# EAGLE design 32u4 with A9G GPRS GSM GPS  v1.0 (EAGLE 6.1)
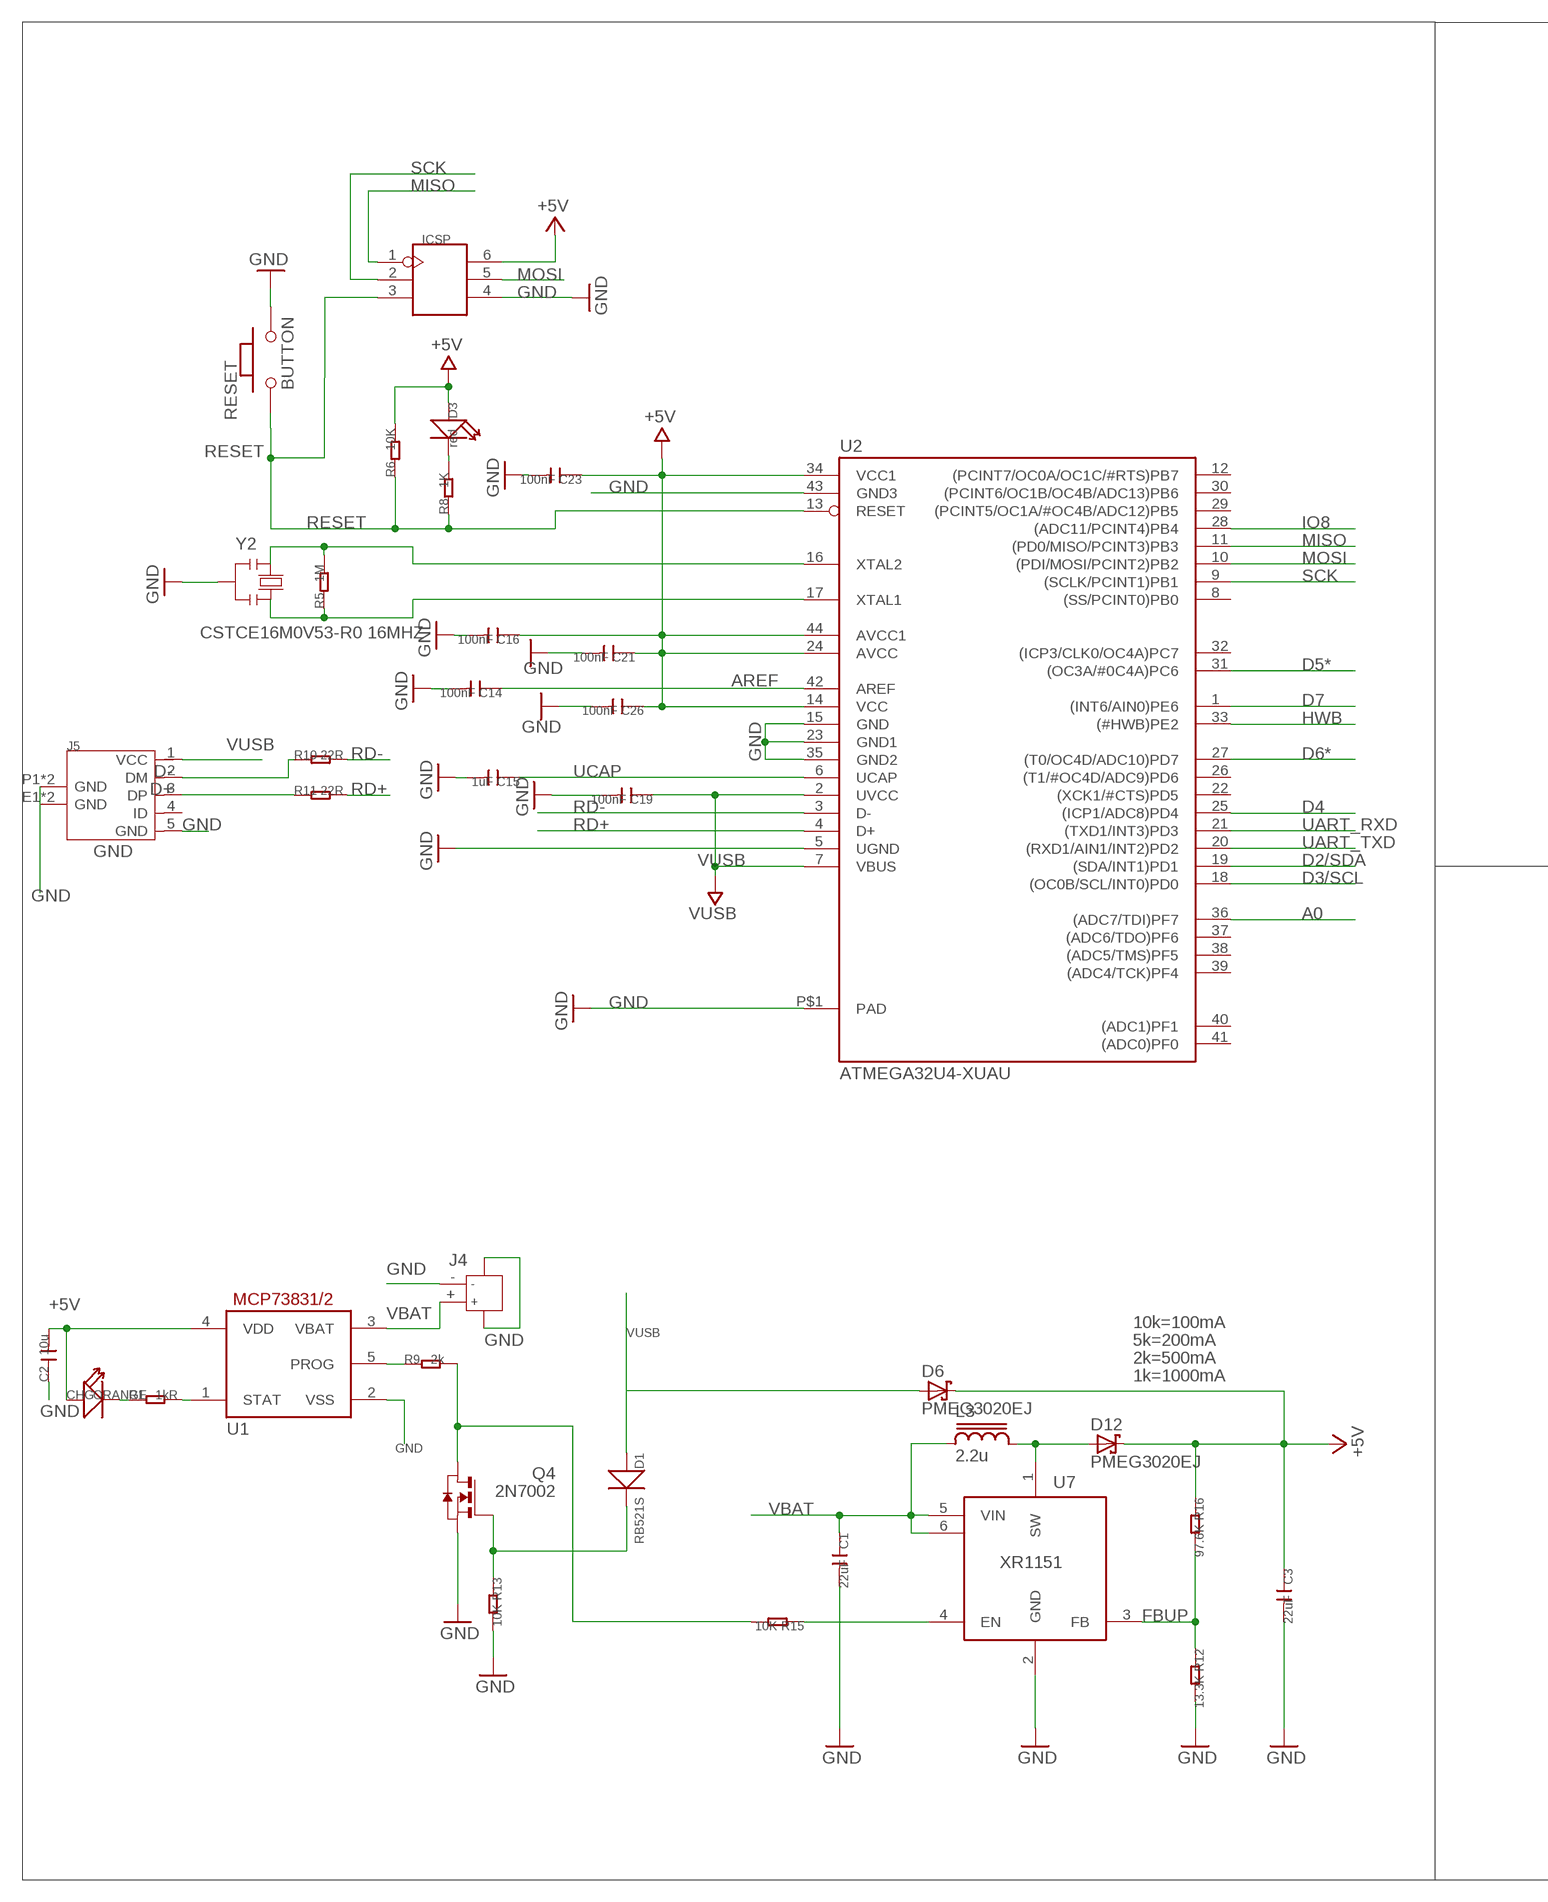
[diagram p0: schematic, sheet 1, part 1 of 2]
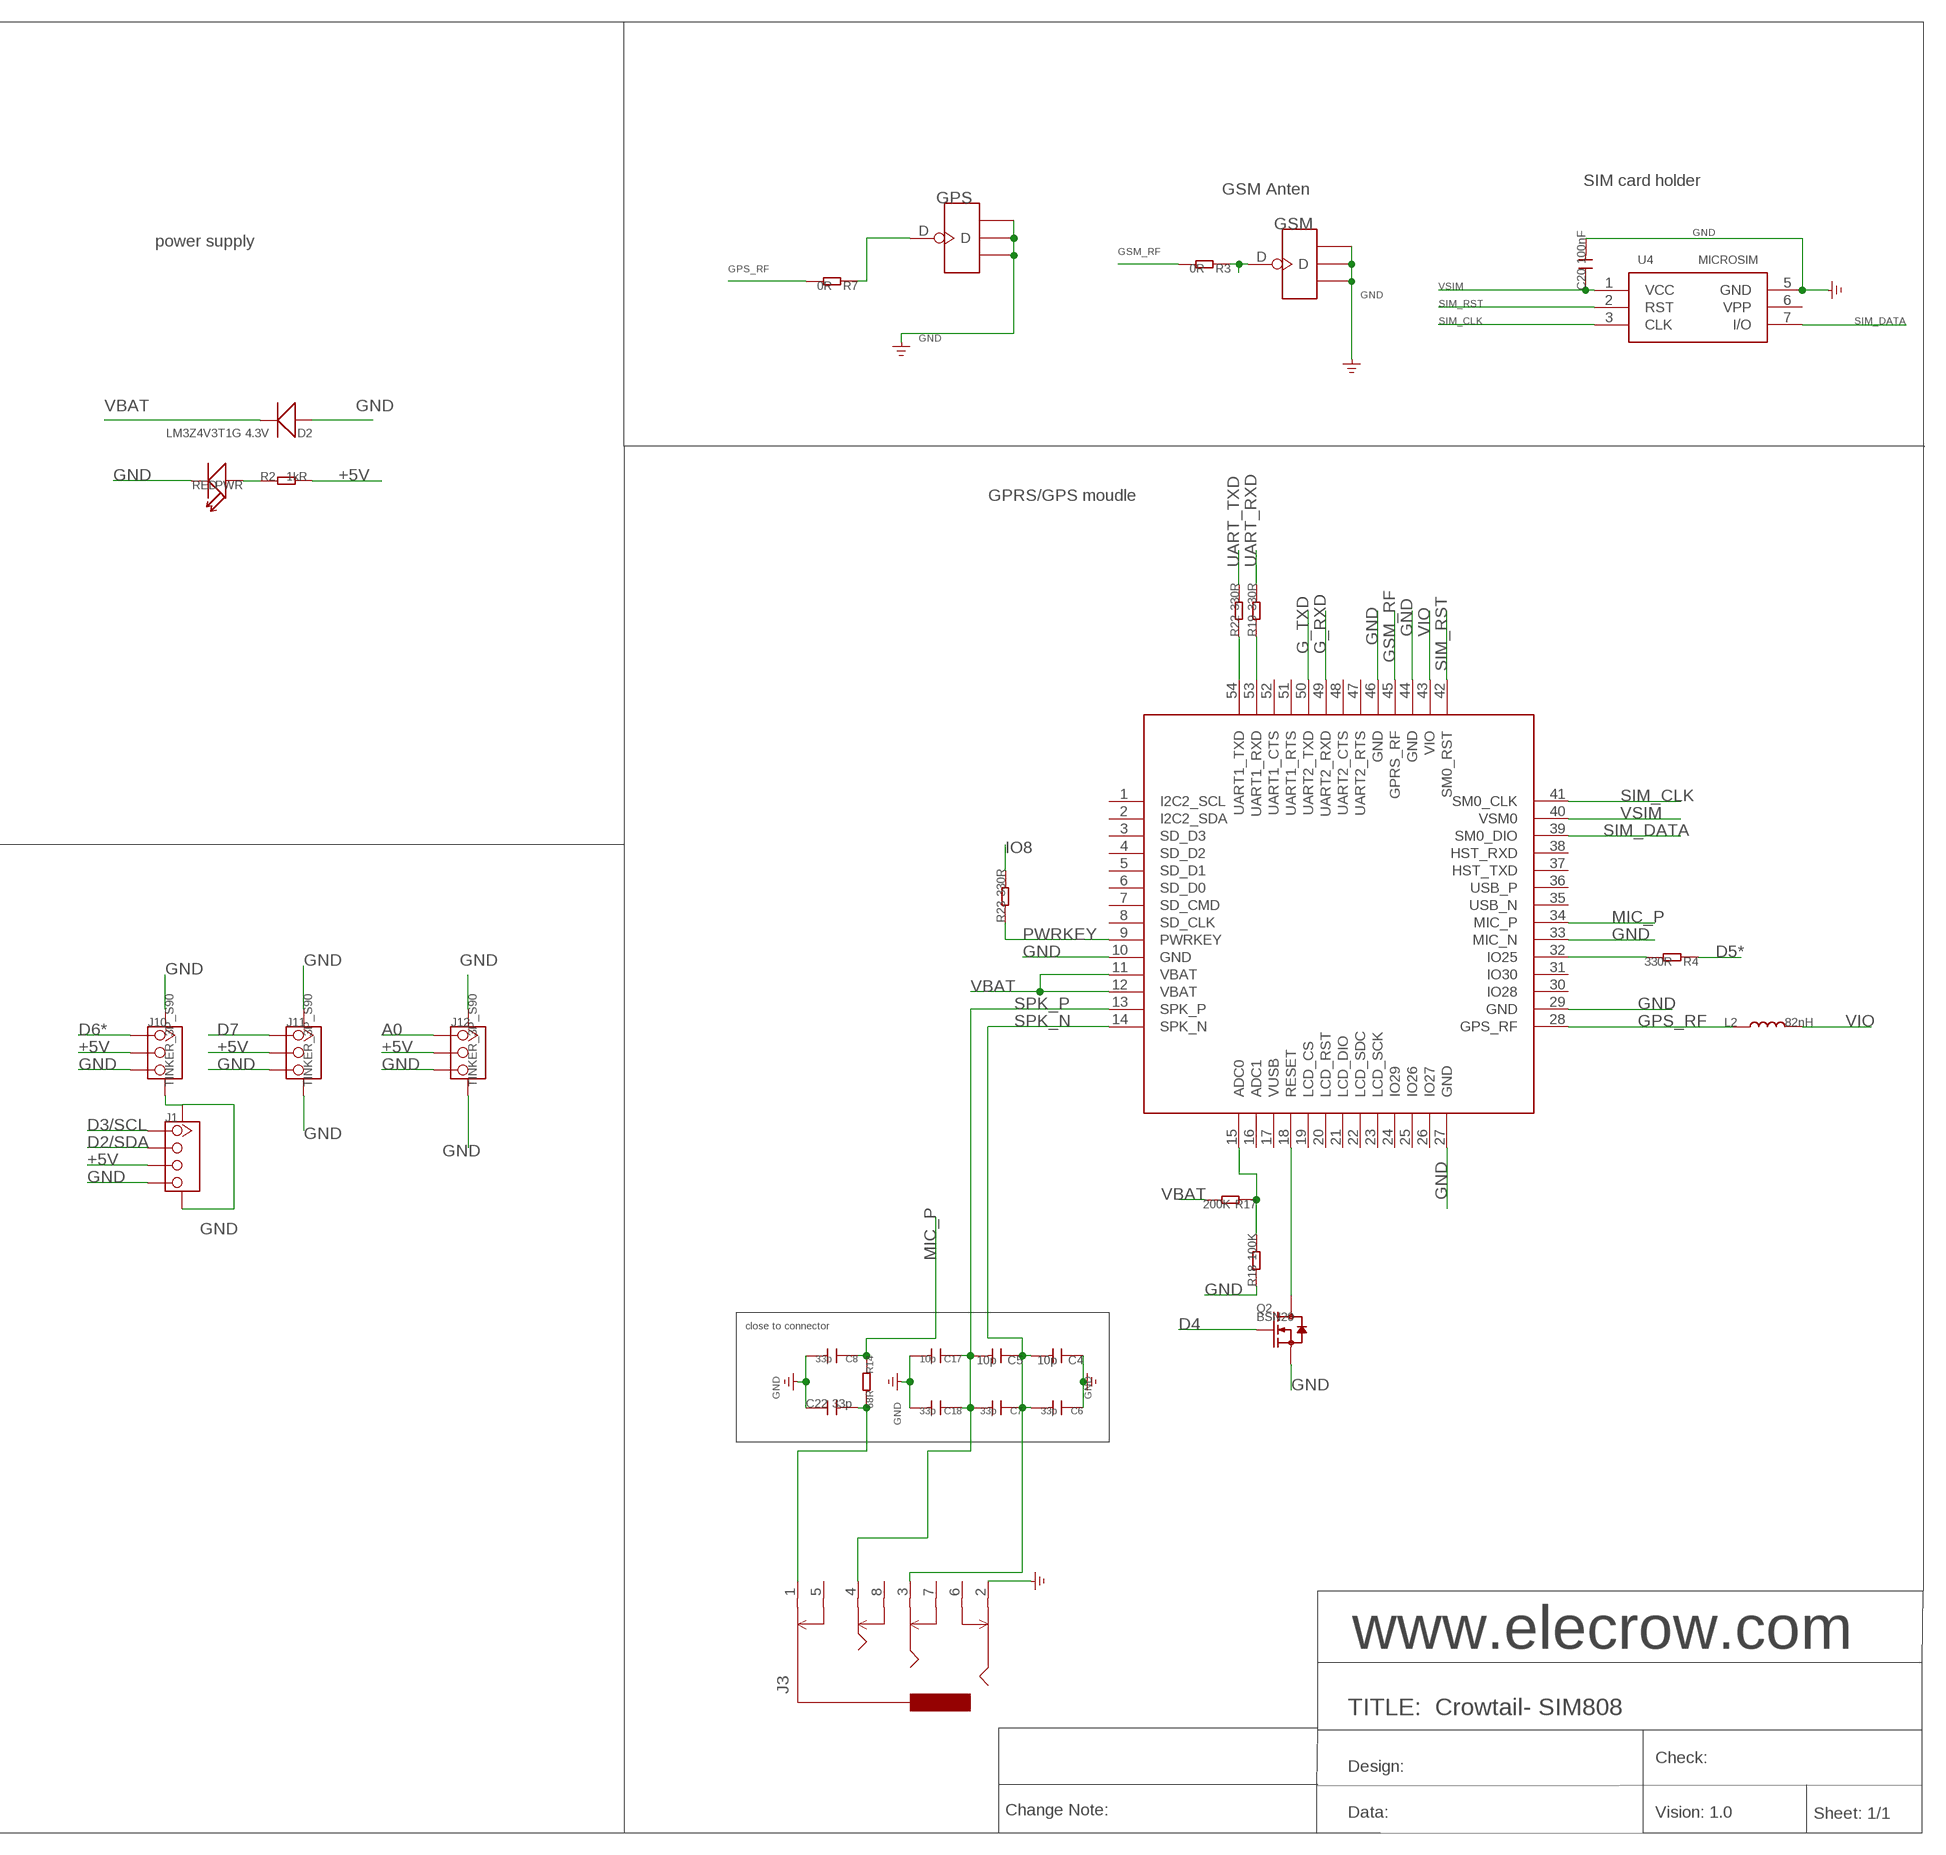
[diagram p1: schematic, sheet 1, part 2 of 2]

## Parts
C1  22uF  C-0603  [C0603]
C2  10u  C-0603  [C0603]
C3  22uF  C-0603  [C0603]
C4  10p  C-0402  [C0402]
C5  10p  C-0402  [C0402]
C6  33p  C-0402  [C0402]
C7  33p  C-0402  [C0402]
C8  33p  C-0603  [C0603]
C14  100nF  C-0603  [C0603]
C15  1uF  C-0603  [C0603]
C16  100nF  C-0603  [C0603]
C17  10p  C-0402  [C0402]
C18  33p  C-0402  [C0402]
C19  100nF  C-0603  [C0603]
C20  100nF  C-0603  [C0603]
C21  100nF  C-0603  [C0603]
C22  33p  C-0603  [C0603]
C23  100nF  C-0603  [C0603]
C26  100nF  C-0603  [C0603]
CHG  ORANGE  007-LED0603  [D0603]
D1  RB521S  D'0603'  [SOD523]
D2  LM3Z4V3T1G 4.3V  D'0805'  [SOD323]
D3  red  LED'0603'  [LED-0603]
D6  PMEG3020EJ  [SOD-323]
D12  PMEG3020EJ  [SOD-323]
GPS  ANTENNA-U-FL  [4P-U-FL]
GSM  ANTENNA-U-FL  [4P-U-FL]
ICSP  HEADER-2X3P-2.0  [2X3P-2.0]
J1  TWIG-4P-2.0-SMD-FEMALE-REINFORCE'90D'  [4P-SMD-2.0-90D]
J3  AUDIO-8P'PJ-3536-L6S'  [8P-3.5-SMD]
J4  JACK-JST-2P-SMD-PW'2.0'  [JST-SMD-2.0-90D]
J5  MICRO-USB-5P-340015001  [B-SMD-5P]
J10  TINKER_3P_S90  [TINKER_3P_S90]
J11  TINKER_3P_S90  [TINKER_3P_S90]
J12  TINKER_3P_S90  [TINKER_3P_S90]
L2  82nH  L'0603'  [L0603]
L3  2.2u  LCD32  [CD32]
PWR  RED  007-LED0603  [D0603]
Q2  BSN20  MOSFET-N'SOT23'  [SOT23@1]
Q4  2N7002  [SOT23]
R1  1kR  R-0603  [R0603]
R2  1kR  R-0603  [R0603]
R3  0R  R-0603  [R0603]
R4  330R  R-0603  [R0603]
R5  1M  R-0603  [R0603]
R6  10K  R-0603  [R0603]
R7  0R  R-0603  [R0603]
R8  1K  R-0603  [R0603]
R9  2k  R-0603  [R0603]
R10  22R  R-0603  [R0603]
R11  22R  R-0603  [R0603]
R12  13.3K  R-0603  [R0603]
R13  10K  R-0603  [R0603]
R14  68R  R-0603  [R0603]
R15  10K  R-0603  [R0603]
R16  97.6K  R-0603  [R0603]
R17  200K  R-0603  [R0603]
R18  100K  R-0603  [R0603]
R19  330R  R-0603  [R0603]
R22  330R  R-0603  [R0603]
R23  330R  R-0603  [R0603]
RESET  BUTTON  PB157  [157SW]
U1  MCP73831/OT  [SOT23-5L]
U2  ATMEGA32U4-XUAU  [TQFP44-PAD]
U4  MICROSIM  [MICROSIM]
U5  A9G  [A9G]
U7  XR1151  [SOT23-6L]
Y2  CSTCE16M0V53-R0 16MHZ  RESONATORMU  [RESONATOR]

## Nets
+5V: C2.2 C3.1 C16.1 C21.1 C23.1 C26.1 CHG.+ D3.+ D6.C D12.C ICSP.6 J1.3 J10.2 J11.2 J12.2 R2.2 R6.2 R16.1 U1.4(VDD) U2.14(VCC) U2.24(AVCC) U2.34(VCC1) U2.44(AVCC1)
A0: J12.1 U2.36((ADC7/TDI)PF7)
AREF [aref]: C14.1 U2.42(AREF)
D2/SDA: J1.2 U2.19((SDA/INT1)PD1)
D3/SCL: J1.1 U2.18((OC0B/SCL/INT0)PD0)
D4: Q2.1(G) U2.25((ICP1/ADC8)PD4)
D5*: R4.1 U2.31((OC3A/#0C4A)PC6)
D6*: J10.1 U2.27((T0/OC4D/ADC10)PD7)
D7: J11.1 U2.1((INT6/AIN0)PE6)
D+: J5.3(DP) R11.1
D-: J5.2(DM) R10.1
FBUP: R12.1 R16.2 U7.3(FB)
G_RXD: U5.49(UART2_RXD)
G_TXD: U5.50(UART2_TXD)
GND: C1.2 C2.1 C3.2 C4.1 C6.1 C8.2 C14.2 C15.2 C16.2 C17.2 C18.2 C19.2 C20.2 C21.2 C22.1 C23.2 C26.2 D2.+ GPS.GND1 GPS.GND2 GPS.GND3 GSM.GND1 GSM.GND2 GSM.GND3 ICSP.4 J1.4 J1.SS1 J1.SS2 J3.2 J4.3 J4.4 J4.- J5.5(GND) J5.E1(GND) J5.E2(GND) J5.P1(GND) J5.P2(GND) J10.3 J10.SS1 J10.SS2 J11.3 J11.SS1 J11.SS2 J12.3 J12.SS1 J12.SS2 PWR.- Q2.2(S) Q4.2(S) R12.2 R13.2 R18.1 RESET.2 U1.2(VSS) U2.5(UGND) U2.15(GND) U2.23(GND1) U2.35(GND2) U2.43(GND3) U2.P$1(PAD) U4.5(GND) U5.10(GND) U5.27(GND) U5.29(GND) U5.33(MIC_N) U5.44(GND) U5.46(GND) U7.2(GND) Y2.2
GPIO2: R4.2 U5.32(IO25)
GPS_RF: L2.1 R7.2 U5.28(GPS_RF)
GSM_RF: R3.2 U5.45(GPRS_RF)
HWB: U2.33((#HWB)PE2)
IO8: R23.2 U2.28((ADC11/PCINT4)PB4)
MIC_P: C8.1 R14.1 U5.34(MIC_P)
MISO: ICSP.1 U2.11((PD0/MISO/PCINT3)PB3)
MOSI: ICSP.5 U2.10((PDI/MOSI/PCINT2)PB2)
N$1: D12.A L3.2 U7.1(SW)
N$2: Q4.3(D) R9.2 R15.2
N$3: D1.- Q4.1(G) R13.1
N$4: R17.1 R18.2 U5.15(ADC0)
N$5: GSM.D R3.1
N$6: PWR.+ R2.1
N$7: GPS.D R7.1
N$8: Q2.3(D) U5.18(RESET)
N$9: R19.1 U5.53(UART1_RXD)
N$10: R15.1 U7.4(EN)
N$11: CHG.- R1.1
N$12: R22.1 U5.54(UART1_TXD)
N$15: D3.- R8.2
N$20: R1.2 U1.1(STAT)
N$30: C22.2 J3.1 R14.2
N$31: R9.1 U1.5(PROG)
PWRKEY: R23.1 U5.9(PWRKEY)
RD+: R11.2 U2.4(D+)
RD-: R10.2 U2.3(D-)
RESET: ICSP.3 R6.1 R8.1 RESET.1 U2.13(RESET)
SCK: ICSP.2 U2.9((SCLK/PCINT1)PB1)
SIM_CLK: U4.3(CLK) U5.41(SM0_CLK)
SIM_DATA: U4.7(I/O) U5.39(SM0_DIO)
SIM_RST: U4.2(RST) U5.42(SM0_RST)
SPK_N: C4.2 C5.1 C6.2 C7.1 J3.3 U5.14(SPK_N)
SPK_P: C5.2 C7.2 C17.1 C18.1 J3.4 U5.13(SPK_P)
UART_RXD: R19.2 U2.21((TXD1/INT3)PD3)
UART_TXD: R22.2 U2.20((RXD1/AIN1/INT2)PD2)
UCAP: C15.1 U2.6(UCAP)
VBAT: C1.1 D2.- J4.+ L3.1 R17.2 U1.3(VBAT) U5.11(VBAT) U5.12(VBAT) U7.5(VIN) U7.6(VIN1)
VIO: L2.2 U5.43(VIO)
VSIM: C20.1 U4.1(VCC) U5.40(VSM0)
VUSB: C19.1 D1.+ D6.A J5.1(VCC) U2.2(UVCC) U2.7(VBUS)
XTAL3: R5.2 U2.16(XTAL2) Y2.1
XTAL4: R5.1 U2.17(XTAL1) Y2.3
Unconnected: J3.5 J3.6 J3.7 J3.8 J5.4(ID) U2.8((SS/PCINT0)PB0) U2.12((PCINT7/OC0A/OC1C/#RTS)PB7) U2.22((XCK1/#CTS)PD5) U2.26((T1/#OC4D/ADC9)PD6) U2.29((PCINT5/OC1A/#OC4B/ADC12)PB5) U2.30((PCINT6/OC1B/OC4B/ADC13)PB6) U2.32((ICP3/CLK0/OC4A)PC7) U2.37((ADC6/TDO)PF6) U2.38((ADC5/TMS)PF5) U2.39((ADC4/TCK)PF4) U2.40((ADC1)PF1) U2.41((ADC0)PF0) U4.6(VPP) U5.1(I2C2_SCL) U5.2(I2C2_SDA) U5.3(SD_D3) U5.4(SD_D2) U5.5(SD_D1) U5.6(SD_D0) U5.7(SD_CMD) U5.8(SD_CLK) U5.16(ADC1) U5.17(VUSB) U5.19(LCD_CS) U5.20(LCD_RST) U5.21(LCD_DIO) U5.22(LCD_SDC) U5.23(LCD_SCK) U5.24(IO29) U5.25(IO26) U5.26(IO27) U5.30(IO28) U5.31(IO30) U5.35(USB_N) U5.36(USB_P) U5.37(HST_TXD) U5.38(HST_RXD) U5.47(UART2_RTS) U5.48(UART2_CTS) U5.51(UART1_RTS) U5.52(UART1_CTS)

## Notes on the sheet
- SIM card holder
- GSM Anten
- power supply
- GPRS/GPS moudle
- 10k=100mA
- 5k=200mA
- 2k=500mA | close to connector
- 1k=1000mA
- www.elecrow.com
- TITLE:  Crowtail- SIM808
- Check:
- Design:
- Change Note: | Data: | Vision: 1.0 | Sheet: 1/1

## Library data of the parts
C1-C8 C14-C23 C26 = Discrete:C*: Ceramic Capacitors
CHG PWR = Discrete:007-LED*
D1 D2 = Discrete:D*
D3 = Discrete:LED*
D6 D12 = Max-Diodes:PMEG3020
GPS GSM = Connector:ANTENNA-U-FL
ICSP = Connector:HEADER-2X3P
J1 = Connector:TWIG-4P-2.0-SMD-FEMALE-REINFORCE
J3 = template:AUDIO-8P
J4 = Connector:JACK-JST-2P-SMD-PW
J5 = OPL Eagle Library:MICRO-USB-5P: ST-USB-001E：MICRO USB B SMD R/A
J10-J12 = Connector:TINKER_3P_S90
L2 = Discrete:L*
L3 = Max-RCL:L
Q2 = Discrete:MOSFET-N: IRLL014: http://www.vishay.com/docs/91319/sihll014.pdf
Q4 = Max-Mosfets:2N7002
R1-R19 R22 R23 = Discrete:R*
RESET = MySMD:PB157
U1 = adafruit:MCP73831: MCP73831/2 Miniature Single-Cell, Fully Integrated Li-Ion, Li-Polymer Charge Management Controllers. Nice and small simple lipoly charge controller, with adjustable current and status output (LED) http://www.ladyada.net/library/pcb/eaglelibrary.html
U2 = SmartPrj:ATMEGA32U4-XU
U4 = Connector:MICROSIM
U5 = IC:A9G
U7 = Max-SwitchingRegulators:XR1151
Y2 = SmartPrj:RESONATOR

## Net classes
0 default: width 0.152 mm, drill 0.152 mm, clearance 0.152 mm
1 power: width 0.61 mm, drill 0.61 mm, clearance 0.203 mm
2 gnd: width 0.305 mm, drill 0.559 mm, clearance 0.203 mm
3 usbvcc: width 0.508 mm, drill 0.61 mm, clearance 0.203 mm
4 aref: width 0.254 mm, drill 0.61 mm, clearance 0.254 mm

## Board
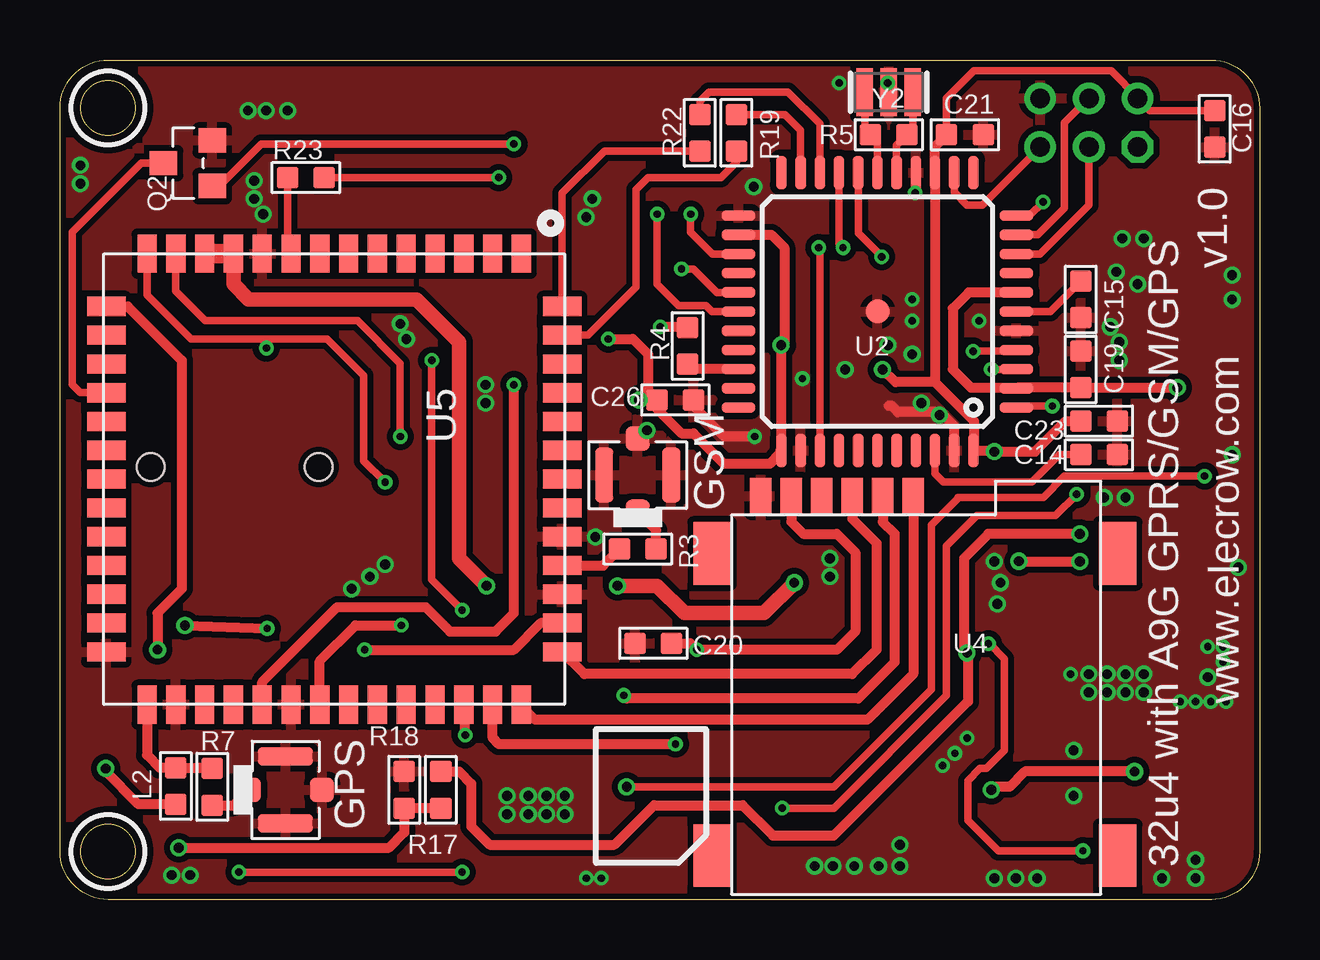
[diagram p2: board, top side]
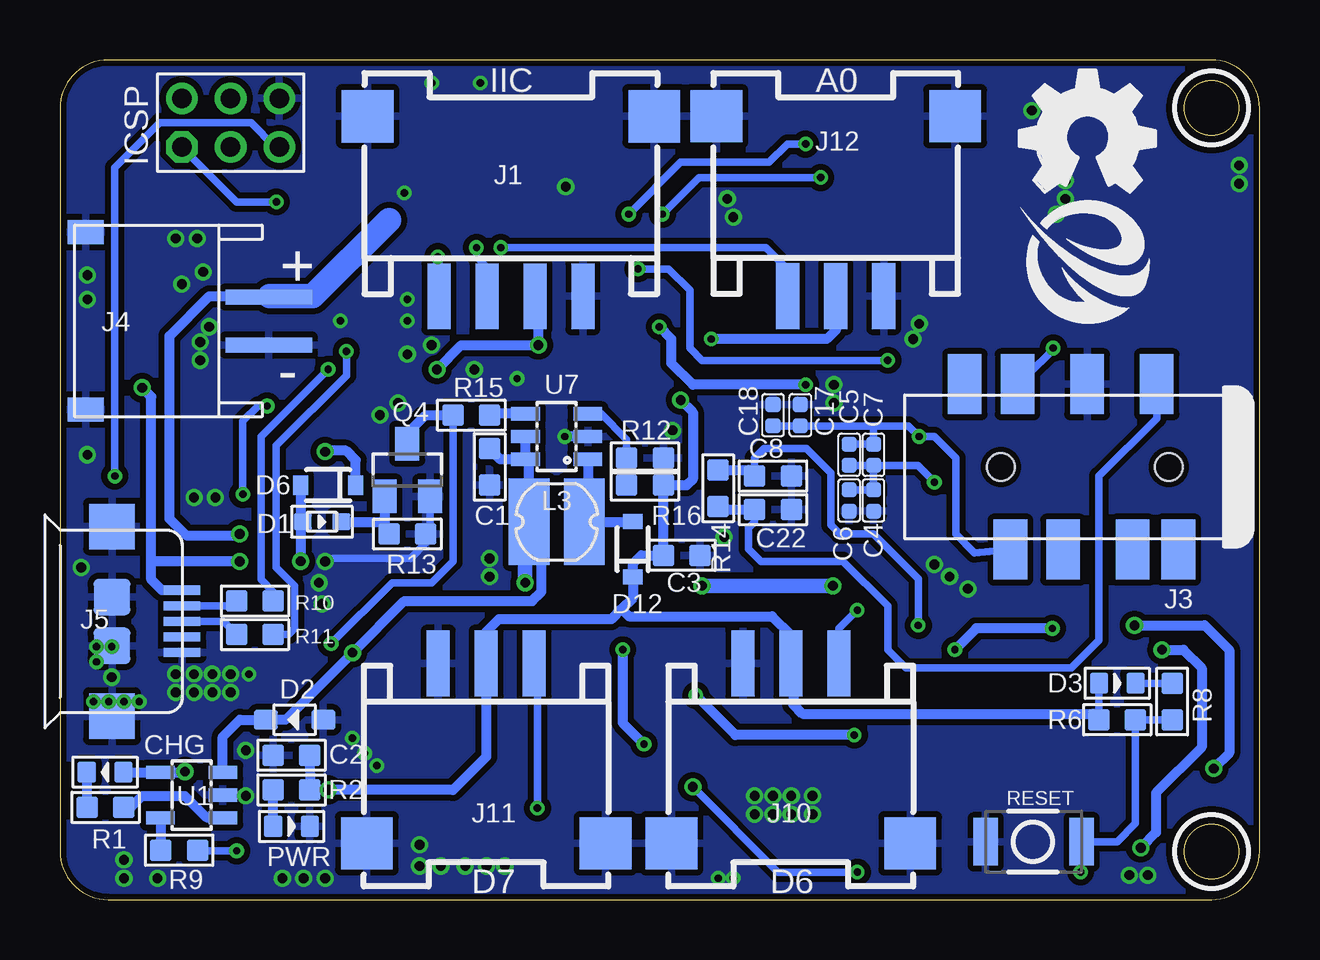
[diagram p3: board, bottom side, seen from below]

Size 50 x 35 mm. Coordinates in mm from the lower left corner, seen from the top.
Outline: 50,33 50,2 arc-90 48,0 2,0 arc-90 0,2 0,33 arc-90 2,35 48,35 arc-90 50,33
Outline: circle at 2,2 radius 1.14
Outline: circle at 2,33 radius 1.14
Copper layers (1*16): Top 0.035mm / dielectric 1.5mm / Bottom 0.035mm
Design rules "default": minimum track width 6mil, minimum drill 12mil, track to track 6mil, track to pad 6mil, pad to pad 6mil, via to via 6mil, smd to smd 0mil, copper to edge 10mil, drill to drill 10mil, minimum pad ring 10mil, minimum via ring 6mil, stop-mask expansion 2mil, vias tented up to drill 100mil, thermal gap 10mil
tRestrict: area 0.5,0.5 to 3.5,3.5; area 0.5,31.5 to 3.5,34.5
bRestrict: area 14.3,41.9 to 14.4,43.3; area 0.5,0.5 to 3.5,3.5; area 0.5,31.5 to 3.5,34.5

### Footprints (pad centres in the part's own frame; a part is rotated, then mirrored left to right if it is on the bottom)
C0603 = smd 0.889 x 0.889: 1 -0.762,0; 2 0.762,0
C0402 = smd 0.635 x 0.635: 1 -0.445,0; 2 0.445,0
D0603 = smd 0.762 x 0.889: + -0.762,0; - 0.762,0
SOD523 = smd 0.762 x 0.7: + -0.8,0; - 0.8,0
SOD323 = smd 1 x 0.8: + -1.2,0; - 1.2,0
LED-0603 = smd 0.762 x 0.889: + -0.762,0; - 0.762,0
SOD-323 = smd 0.63 x 0.83: A 1.15,0; C -1.15,0
4P-U-FL = smd 1.016 x 1.016: D -1.524,0; GND3 1.524,0 | smd 2.286 x 0.762: GND1 0,1.397; GND2 0,-1.397
2X3P-2.0 = drill 0.813 pad 1.27 octagon: 1 -1.016,2.032 | drill 0.813 pad 1.27: 2 -1.016,0; 3 -1.016,-2.032; 4 1.016,-2.032; 5 1.016,0; 6 1.016,2.032
4P-SMD-2.0-90D = smd 0.965 x 2.74: 1 -3,-0.1; 2 -1,-0.1; 3 1,-0.1; 4 3,-0.1 | smd 2.159 x 2.184: SS1 -5.974,7.4; SS2 5.974,7.4
8P-3.5-SMD = smd 1.4 x 2.5: 1 2.8,-3.45; 2 5.7,-3.45; 3 8.6,-3.45; 4 8.9,3.45; 5 1.9,3.45; 6 3.8,3.45; 7 6.7,3.45; 8 10.8,-3.45 | hole 1.149: 2.3,0; 9.3,0
JST-SMD-2.0-90D = smd 1 x 1.5: 3 3.7,-2.54; 4 -3.7,-2.54 | smd 0.635 x 3.6: + -1,5.08; - 1,5.08
B-SMD-5P = smd 0.38 x 1.52: 1 -1.3,2.54; 2 -0.65,2.54; 3 0,2.54; 4 0.65,2.54; 5 1.3,2.54 | smd 1.524 x 1.524: E1 -1.016,-0.381; E2 1.016,-0.381 | smd 1.9 x 1.9: P1 -3.95,-0.381; P2 3.95,-0.381
TINKER_3P_S90 = smd 0.965 x 2.74: 1 -1.984,-4.545; 2 0.016,-4.545; 3 2.016,-4.545 | smd 2.159 x 2.184: SS1 -4.958,2.955; SS2 4.99,2.955
L0603 = smd 0.889 x 0.889: 1 -0.762,0; 2 0.762,0
CD32 = smd 3.6 x 1.7: 1 0,1.15; 2 0,-1.15
SOT23@1 = smd 1.016 x 1.143: 1 -0.95,-1.016; 2 0.95,-1.016; 3 0,1.016
SOT23 = smd 1 x 1.4: 1 -0.95,-1.1; 2 0.95,-1.1; 3 0,1.1
R0603 = smd 0.889 x 0.889: 1 -0.762,0; 2 0.762,0
157SW = smd 1.016 x 1.981: 1 0,0; 2 4,0
SOT23-5L = smd 0.55 x 1.2: 1 -0.95,-1.3; 2 0,-1.3; 3 0.95,-1.3; 4 0.95,1.3; 5 -0.95,1.3
TQFP44-PAD = smd 1.4 x 0.45: 1 -5.8,4; 2 -5.8,3.2; 3 -5.8,2.4; 4 -5.8,1.6; 5 -5.8,0.8; 6 -5.8,0; 7 -5.8,-0.8; 8 -5.8,-1.6; 9 -5.8,-2.4; 10 -5.8,-3.2; 11 -5.8,-4; 23 5.8,-4; 24 5.8,-3.2; 25 5.8,-2.4; 26 5.8,-1.6; 27 5.8,-0.8; 28 5.8,0; 29 5.8,0.8; 30 5.8,1.6; 31 5.8,2.4; 32 5.8,3.2; 33 5.8,4 | smd 0.45 x 1.4: 12 -4,-5.8; 13 -3.2,-5.8; 14 -2.4,-5.8; 15 -1.6,-5.8; 16 -0.8,-5.8; 17 0,-5.8; 18 0.8,-5.8; 19 1.6,-5.8; 20 2.4,-5.8; 21 3.2,-5.8; 22 4,-5.8; 34 4,5.8; 35 3.2,5.8; 36 2.4,5.8; 37 1.6,5.8; 38 0.8,5.8; 39 0,5.8; 40 -0.8,5.8; 41 -1.6,5.8; 42 -2.4,5.8; 43 -3.2,5.8; 44 -4,5.8 | smd 1 x 1: P$1 0,0
MICROSIM = smd 1.5 x 0.9: 1 -0.8,2.5; 2 -0.8,5.04; 3 -0.8,7.58; 5 -0.8,1.23; 6 -0.8,3.77; 7 -0.8,6.31 | smd 2.61 x 1.56: P$1 1.6,-0.8; P$2 14.2,-0.8; P$3 14.2,16.1; P$4 1.6,16.1
A9G = smd 1.6 x 0.8: 1 -9.4,7.8; 2 -9.4,6.6; 3 -9.4,5.4; 4 -9.4,4.2; 5 -9.4,3; 6 -9.4,1.8; 7 -9.4,0.6; 8 -9.4,-0.6; 9 -9.4,-1.8; 10 -9.4,-3; 11 -9.4,-4.2; 12 -9.4,-5.4; 13 -9.4,-6.6; 14 -9.4,-7.8; 28 9.4,-7.8; 29 9.4,-6.6; 30 9.4,-5.4; 31 9.4,-4.2; 32 9.4,-3; 33 9.4,-1.8; 34 9.4,-0.6; 35 9.4,0.6; 36 9.4,1.8; 37 9.4,3; 38 9.4,4.2; 39 9.4,5.4; 40 9.4,6.6; 41 9.4,7.8 | smd 0.8 x 1.6: 15 -7.2,-9.5; 16 -6,-9.5; 17 -4.8,-9.5; 18 -3.6,-9.5; 19 -2.4,-9.5; 20 -1.2,-9.5; 21 0,-9.5; 22 1.2,-9.5; 23 2.4,-9.5; 24 3.6,-9.5; 25 4.8,-9.5; 26 6,-9.5; 27 7.2,-9.5; 42 7.2,9.5; 43 6,9.5; 44 4.8,9.5; 45 3.6,9.5; 46 2.4,9.5; 47 1.2,9.5; 48 0,9.5; 49 -1.2,9.5; 50 -2.4,9.5; 51 -3.6,9.5; 52 -4.8,9.5; 53 -6,9.5; 54 -7.2,9.5
SOT23-6L = smd 0.55 x 1.2: 1 -0.95,-1.3; 2 0,-1.3; 3 0.95,-1.3; 4 0.95,1.3; 5 0,1.3; 6 -0.95,1.3
RESONATOR = smd 0.7 x 2: 1 -1,0; 2 0,0; 3 1,0

### Placement (x,y rotation side)
C1  32.09,18.03 270 bottom
C2  40.35,6.02 0 bottom
C3  24.09,14.35 0 bottom
C4  16.09,16.64 90 bottom
C5  17.11,18.54 90 bottom
C6  17.11,16.64 90 bottom
C7  16.09,18.54 90 bottom
C8  20.28,17.65 0 bottom
C14  43.31,18.54 0 top
C15  42.55,25.02 270 top
C16  48.13,32.13 270 top
C17  19.14,20.19 90 bottom
C18  20.28,20.19 90 bottom
C19  42.55,22.1 90 top
C20  24.73,10.69 180 top
C21  37.72,31.88 0 top
C22  20.28,16.26 180 bottom
C23  43.31,19.94 0 top
C26  25.65,20.83 0 top
CHG  48.12,5.31 180 bottom
D1  39.08,15.75 0 bottom
D2  40.22,7.49 180 bottom
D3  5.93,9.02 0 bottom
D6  38.82,17.27 180 bottom
D12  26.12,14.61 90 bottom
GPS  9.4,4.57 0 top
GSM  24.08,17.69 90 top
ICSP  42.89,32.38 90 bottom
J1  31.2,25.25 0 bottom
J3  1.49,18.03 180 bottom
J4  46.38,24.12 270 bottom
J5  47.45,11.6 270 bottom
J10  19.52,5.3 180 bottom
J11  32.22,5.3 180 bottom
J12  17.68,29.7 0 bottom
L2  4.83,4.74 270 top
L3  29.3,15.75 90 bottom
LOGO2  LOGO-OSHW-FILLX0200-NT  [OSHW_FILLX200_NOTEXT]  10.01,29.5 0 bottom
PWR  40.35,3.05 0 bottom
Q2  5.33,30.7 90 top
Q4  35.52,17.91 0 bottom
R1  48.1,3.84 0 bottom
R2  40.35,4.57 0 bottom
R3  24.08,14.61 180 top
R4  26.16,23.08 90 top
R5  34.54,31.88 0 top
R6  5.93,7.49 180 bottom
R7  6.35,4.7 90 top
R8  3.65,8.26 90 bottom
R9  45.03,2.06 0 bottom
R10  41.87,12.45 0 bottom
R11  41.87,11.05 0 bottom
R12  25.62,18.41 0 bottom
R13  35.52,15.24 0 bottom
R14  22.57,17.14 270 bottom
R15  32.85,20.19 180 bottom
R16  25.62,17.27 180 bottom
R17  15.88,4.57 90 top
R18  14.35,4.57 270 top
R19  28.19,31.97 90 top
R22  26.67,31.97 90 top
R23  10.25,30.1 0 top
RESET  7.42,2.41 180 bottom
U1  44.51,4.36 90 bottom
U2  34.07,24.51 180 top
U4  27.99,16.03 270 top
U5  11.43,17.53 270 top
U7  29.3,19.3 90 bottom
U$1  [ELECROW-NEW]  10.01,24 0 bottom
Y2  34.54,33.66 180 top

### Tracks (layer width: path | path; a pad name or v marks a point on that pad's centre or on a via)
+5V  (via drill 0.3, 0.41)
  Top 0.305: C16.1 45.43,32.89 ICSP.6 44.96,33.4 43.81,34.54 38.1,34.54 36.96,33.4 C21.1 | U2.34 30.01,18.71
  Top 0.406: C21.1 36.47,31.39 U2.14 36.47,21.57 | 36.47,21.57 38.1,19.94 38.1,18.74 U2.44 38.91,18.71 v38.95,18.67 40.64,18.67 41.91,19.94 C23.1 | 36.47,21.57 34.82,21.57 v34.29,22.1 | U2.34 30.07,23.1 v30.06,23.11 30.19,23.24 30.19,27.18 29.66,27.71 U2.24 | v44.79,5.33 40.22,5.33 39.59,4.7 38.95,4.7 v38.82,4.57 | 30.01,18.71 30.01,18.58 29.59,18.16 27.69,18.16 26.42,19.43 25.91,19.43 24.89,20.45 C26.1 | v22.86,23.37 23.88,23.37 24.51,22.73 24.51,21.21 C26.1 | v24.13,20.83 C26.1
  Bottom 0.305: D3.+ R6.2 | 19.56,9.82 J10.2
  Bottom 0.406: 26.59,12.11 26.12,12.57 D12.C 26.12,14.01 25.78,14.35 C3.1 R16.1 23.88,17.27 23.62,17.53 23.62,20.32 v24.13,20.83 | 26.59,12.11 27.01,11.68 31.71,11.68 32.24,11.16 J11.2 32.24,5.95 33.62,4.57 v38.82,4.57 R2.2 39.56,4.59 C2.2 | 17.65,25.14 J12.2 17.66,23.74 18.03,23.37 v22.86,23.37 | 19.43,9.78 19.56,9.91 19.56,11.05 20.32,11.81 26.29,11.81 26.59,12.11 | 19.43,9.78 19.47,9.78 J10.2 | v34.29,22.1 33.27,23.11 v30.06,23.11 30.06,25.01 J1.3 | 38.89,18.61 v38.95,18.67 38.91,18.71 U2.44 37.67,18.31 D6.C | CHG.+ U1.4 44.82,5.31 v44.79,5.33 | 19.43,9.78 19.43,8.13 19.05,7.75 6.95,7.75 R6.2
A0  (via drill 0.3)
  Top 0.305: U2.36 31.67,27.13 v31.62,27.18
  Bottom 0.305: v31.62,27.18 20.57,27.18 19.56,26.16 19.56,25.15 19.68,25.27
  Bottom 0.406: 19.52,25.27 19.64,25.16 J12.1 19.66,25.15 19.56,25.15
AREF
  Top 0.305: C14.1 41.66,18.54 40.51,17.4 36.83,17.4 36.47,17.75 U2.42
D2/SDA  (via drill 0.3)
  Top 0.305: U2.19 32.47,27.34 v32.64,27.18
  Bottom 0.305: v32.64,27.18 32.64,26.8 32.26,26.42 32.26,25.4 32,25.15 J1.2 | 32.26,25.15 J1.2 | J1.2
D3/SCL  (via drill 0.3)
  Top 0.305: U2.18 33.27,27.77 v34.25,26.8
  Bottom 0.406: v34.25,26.8 34.25,25.2 J1.1
D4  (via drill 0.3)
  Top 0.305: Q2.1 6.63,29.75 8.38,31.5 v18.92,31.5 | v26.29,28.57 26.29,27.81 27.19,26.91 U2.25
  Bottom 0.305: v18.92,31.5 19.68,31.5 20.45,30.73 24.13,30.73 v26.29,28.57
D5*
  Top 0.406: U2.31 26.36,22.11 R4.1
D6*  (via drill 0.3)
  Top 0.305: U2.27 27.39,25.31 26.42,26.29 v25.91,26.29 | v16.76,12.06 15.49,13.34 v15.49,22.48
  Bottom 0.305: v16.76,12.06 17.54,11.29 J10.1 | v15.49,22.48 23.24,22.48 23.75,22.99 23.75,25.4 24.64,26.29 v25.91,26.29
D7  (via drill 0.3)
  Top 0.305: v41.36,20.57 39.94,20.57 U2.1 | v42.38,16.89 41.49,16 38.23,16 36.96,14.73 36.96,8.51 32.26,3.81 v30.1,3.81
  Bottom 0.305: v30.1,3.81 30.1,9.71 J11.1 | v42.38,16.89 42.38,19.94 41.74,20.57 v41.36,20.57
D+
  Bottom 0.305: J5.3 43.18,11.6 R11.1
D-
  Bottom 0.305: J5.2 42.84,12.24 R10.1
FBUP
  Bottom 0.305: U7.3 27.45,20.25 26.38,19.18 R12.1
  Bottom 0.406: R12.1 R16.2
GND  (via drill 0.3, 0.41)
  Top 0.406: Y2.2 34.54,34 v34.51,34.04 | U2.43 37.27,19.75 36.7,20.32 34.92,20.32 34.67,20.57 34.54,20.57 | U2.15 35.67,29.6 35.69,29.59 35.56,29.46 v35.65,29.46 35.69,29.46 | v28.96,19.3 27.69,19.3 26.42,20.57 C26.2
  Bottom 0.305: v38.95,14.1 38.82,14.22 35.4,14.22 34.76,14.86 R13.2 34.57,15.43 Q4.2
  Bottom 0.406: U7.2 v28.96,19.3
  other vias: 35.52,25.02 35.52,24.13 38.32,24.13 30.95,21.72 42.13,9.4 47.84,10.54 28.92,29.72 32.47,34.04 32.22,1.4 33.11,1.4 39.84,0.89 40.73,0.89 45.17,8.64 43.65,9.4 44.92,25.65 48.86,18.54 44.28,27.56 45.17,27.56 35.52,22.73 32.73,22.1 35.9,20.7 49.11,13.84 48.86,25.02 44.41,8.64 42.89,9.4 35.01,2.29 21.04,3.56 47.33,0.89 45.94,0.89 35.01,1.4 43.52,16.76 44.16,23.24 44.16,22.48 44.03,26.16 39.2,13.21 43.65,8.64 42.25,4.32 31.46,1.4 4.66,1.02 5.42,1.02 43.78,23.88 42.89,8.64 36.66,20.19 34.51,23.11 42.25,6.22 34.12,1.4 44.41,16.76 48.86,26.04 44.41,9.4 45.17,9.4 39.08,12.32 47.84,9.27 47.33,1.65 38.95,0.89 48.48,10.54 48.48,9.91 48.6,8.26 47.97,8.26 47.33,8.26 46.7,8.26 12.92,13.46 12.15,12.95 22.31,15.11 7.84,32.89 8.6,32.89 9.49,32.89 8.09,29.97 8.09,29.21 8.47,28.57 17.74,21.46 17.74,20.7 14.19,24 14.44,23.37 13.55,13.97 32.09,14.22 32.09,13.46 0.85,30.61 0.85,29.84 22.19,29.21 21.93,28.45 24.47,19.56 21.04,4.32 20.28,4.32 19.52,4.32 18.63,4.32 18.63,3.56 19.52,3.56 20.28,3.56 37.81,6.73 37.3,6.1 36.79,5.59 21.93,0.89 22.57,0.89
  pour Top (isolate 0.254): 51.27,-1.27 -0.8,-1.27 -0.8,35.56 51.27,35.56
  pour Bottom (isolate 0.254): 51.27,-1.27 -0.8,-1.27 -0.8,35.56 51.27,35.56
GPIO2  (via drill 0.3)
  Top 0.406: U5.32 8.43,9.06 11.56,12.19 15.24,12.19 16.26,11.18 18.16,11.18 18.92,11.94 v18.92,21.46 | v25.02,23.88 26.12,23.88 R4.2
  Bottom 0.406: v18.92,21.46 23.62,21.46 24.51,22.35 24.51,23.37 v25.02,23.88
GPS_RF
  Top 0.406: U5.28 3.63,6.02 4.15,5.5 L2.1 5.8,5.5 R7.2
GSM_RF
  Top 0.406: U5.45 22.64,13.93 R3.2
IO8  (via drill 0.3)
  Top 0.305: R23.2 v18.29,30.1 | v24.89,28.57 24.89,25.65 25.78,24.77 26.92,24.77 27.18,24.51 U2.28
  Bottom 0.305: v18.29,30.1 23.37,30.1 v24.89,28.57
MIC_P  (via drill 0.3)
  Top 0.406: U5.34 10.83,9.94 12.32,11.43 v14.22,11.43
  Bottom 0.305: v14.22,11.43 14.22,13.37 16.09,15.24 17.49,15.24 17.87,15.62 17.87,17.78 18.89,18.8 20.66,18.8 21.04,18.41 C8.1
  Bottom 0.406: R14.1 21.3,17.91 C8.1
MISO  (via drill 0.3)
  Top 0.305: U2.11 40.41,28.51 v40.98,29.08
  Bottom 0.305: v40.98,29.08 42.63,29.08 ICSP.1
MOSI
  Top 0.305: U2.10 40.75,27.71 41.87,28.83 41.87,32.38 ICSP.5
N$1
  Bottom 0.406: D12.A 26.13,15.75 L3.2 28,15.9 U7.1
N$2  (via drill 0.3)
  Top 0.305: v42.63,2.03 39.12,2.03 37.85,3.3 37.85,4.95 38.35,5.46 38.61,5.46 39.37,6.22 39.37,10.03 38.73,10.67 v38.7,10.67
  Bottom 0.305: v42.63,2.03 44.24,2.03 R9.2 | R15.2 33.62,14.1 34.51,13.21 36.16,13.21 v38.7,10.67
  Bottom 0.406: Q4.3 35.52,19.43 34.76,20.19 33.74,20.19 33.62,20.32 R15.2
N$3
  Bottom 0.406: Q4.1 36.47,15.75 | 36.47,15.75 36.47,15.43 R13.1 | D1.- 36.47,15.75
N$4  (via drill 0.41)
  Top 0.406: R17.1 R18.2 14.35,2.79 13.72,2.16 v4.95,2.16 | v4.06,10.41 4.06,11.94 5.08,12.95 5.08,22.48 2.83,24.73 U5.15
  Bottom 0.406: v4.95,2.16 4.32,2.79 4.32,4.45 2.41,6.35 2.41,9.65 3.17,10.41 v4.06,10.41
N$5
  Top 0.406: R3.1 24.85,15.4 GSM.D
N$6
  Bottom 0.406: PWR.+ R2.1
N$7
  Top 0.406: R7.1 7.24,3.94 GPS.D
N$8
  Top 0.305: U5.18 0.84,21.13 0.51,21.46 0.51,27.81 3.39,30.7 Q2.3
N$9
  Top 0.305: R19.1 28.19,30.73 27.56,30.1 24.51,30.1 24,29.59 24,25.53 22,23.53 U5.53
N$10
  Bottom 0.406: U7.4 32.03,20.25 R15.1
N$11
  Bottom 0.406: CHG.- 48.88,3.86 R1.1
N$12
  Top 0.305: U5.54 20.93,29.44 22.7,31.2 R22.1
N$15
  Bottom 0.305: R8.2 D3.-
N$20
  Bottom 0.406: R1.2 47.05,3.84 46.57,4.32 44.79,4.32 43.9,3.43 43.23,3.43 U1.1
N$30
  Bottom 0.305: 22.19,16.26 R14.2 | J3.1 4.29,20.06 6.69,17.65 6.69,10.79 7.84,9.65 14.73,9.65 15.49,10.41 15.49,12.23 17.36,14.1 20.79,14.1 21.3,14.61 21.3,15.49 21.04,15.75 C22.2
  Bottom 0.406: 22.19,16.26 C22.2
N$31
  Bottom 0.406: U1.5 45.81,2.29 45.68,2.16 R9.1
PWRKEY
  Top 0.305: R23.1 9.49,27.07 U5.9
RD+  (via drill 0.3)
  Top 0.305: v38.06,22.86 39.82,22.86 U2.4
  Bottom 0.305: R11.2 40.48,11.05 40.22,11.3 40.22,13.08 40.98,13.84 40.98,18.92 38.06,21.84 v38.06,22.86
RD-  (via drill 0.3)
  Top 0.305: v38.82,22.1 39.86,22.1 U2.3
  Bottom 0.305: R10.2 41.11,12.83 41.62,13.34 41.62,19.3 v38.82,22.1
RESET  (via drill 0.3, 0.41)
  Top 0.305: U2.13 37.27,29.49 37.81,28.96 38.44,28.96 ICSP.3 | v47.71,17.65 41.87,17.65 40.98,16.76 37.43,16.76 37.43,16.73 36.32,15.62 36.32,8.76 32.26,4.7 v23.62,4.7 | v7.46,1.14 v16.76,1.14
  Bottom 0.305: R8.1 R6.1 5.17,3.17 5.93,2.41 RESET.1 7.46,2.38 v7.46,1.14 | ICSP.3 41.02,31.37 42.04,32.38 45.85,32.38 47.71,30.52 v47.71,17.65 | v16.76,1.14 20.07,1.14 v23.62,4.7
SCK
  Top 0.305: U2.9 40.84,26.91 42.89,28.96 ICSP.2
SIM_CLK
  Top 0.406: U4.3 35.57,9.4 33.66,7.49 19.81,7.49 19.23,8.07 U5.41
SIM_DATA  (via drill 0.3)
  Top 0.406: v23.5,8.51 23.62,8.38 33.27,8.38 34.8,9.91 34.8,15.24 34.29,15.75 34.3,15.75 U4.7 | v16.89,6.86 16.89,8.06 U5.39
  Bottom 0.406: v23.5,8.51 21.84,6.86 v16.89,6.86
SIM_RST
  Top 0.406: U5.42 21.86,9.4 33.02,9.4 34.04,10.41 34.04,14.86 33.03,15.87 U4.2
SPK_N  (via drill 0.3)
  Top 0.305: 8.72,23.37 11.14,23.37 12.66,21.84 12.66,18.29 v13.55,17.4 | v8.6,22.99 8.6,23.24 8.72,23.37 | U5.14 3.63,25.2 5.46,23.37 8.72,23.37
  Bottom 0.305: C6.2 C4.2 C7.1 | C5.1 C7.1 | J3.3 8.56,22.95 v8.6,22.99 | C7.1 14.25,18.1 v13.55,17.4
SPK_P  (via drill 0.3)
  Top 0.305: U5.13 4.83,25.36 6.06,24.13 12.41,24.13 14.19,22.35 v14.19,19.3
  Bottom 0.305: C18.1 C17.1 16.09,19.75 | C5.2 C7.2 16.09,19.75 | 16.09,19.75 14.63,19.75 v14.19,19.3 13.55,19.3 12.66,18.41 12.66,15.24 11.88,14.46 J3.4
UART_RXD
  Top 0.305: U2.21 30.87,32.08 30.23,32.73 R19.2
UART_TXD
  Top 0.305: R22.2 26.67,33.27 27.05,33.66 30.35,33.66 31.67,32.33 U2.20
UCAP
  Top 0.305: U2.6 41.27,24.51 C15.1
VBAT  (via drill 0.41)
  Top 0.406: v42.51,15.24 38.7,15.24 37.68,14.22 37.68,10.41 v37.81,10.29 37.85,10.25 37.85,8.26 32.26,2.67 29.72,2.67 28.45,3.94 24.77,3.94 23.11,2.29 17.91,2.29 17.14,3.05 17.14,4.83 16.64,5.33 R17.2
  Top 0.61: U5.11 7.23,25.66 7.87,25.02 14.86,25.02 16.64,23.24 16.64,14.22 v17.78,13.08 | v23.24,13.08 24.89,13.08 26.04,11.94 29.34,11.94 v30.61,13.21
  Top 0.813: U5.11 U5.12
  Bottom 0.406: 41.27,25.15 J4.+ | 36.28,28.32 36.28,28.07 36.54,27.81 | 41.4,25.02 J4.+ | J4.+ 41.33,25.15 43.78,25.15 45.43,23.5 45.43,15.88 44.74,15.18 42.56,15.18 v42.51,15.24 | 30.57,16 30.44,16.13 | 30.44,16.13 30.44,15.88 | 30.44,15.88 L3.1 | 30.44,15.88 30.45,15.87 L3.1 30.45,15.5 29.93,14.99 29.93,12.83 30.32,12.45 35.65,12.45 v37.81,10.29 40.6,7.49 D2.- 42.51,7.49 43.21,6.79 U1.3 | 30.44,16.13 30.44,18.2 U7.6 | U7.6 U7.5 | U7.6 31.65,18.35 C1.1
  Bottom 0.61: v17.78,13.08 v23.24,13.08 | v30.61,13.21 30.61,15.59 L3.1
  Bottom 1.016: 41.27,25.15 39.46,25.15 36.28,28.32
VIO  (via drill 0.3, 0.41)
  Top 0.406: v5.21,11.43 v8.64,11.3 | v12.7,10.41 18.92,10.41 20.04,11.53 U5.43 | L2.2 3.26,3.98 1.91,5.33 v1.91,5.46
  Bottom 0.406: v8.64,11.3 11.81,11.3 v12.7,10.41 | v5.21,11.43 2.29,11.43 1.27,10.41 1.27,6.1 v1.91,5.46
VSIM  (via drill 0.3)
  Top 0.406: v25.65,6.48 18.29,6.48 18.03,6.73 U5.40 | C20.1 26.27,10.69 v26.54,10.41 32.38,10.41 33.15,11.18 33.15,14.48 32.38,15.24 30.99,15.24 30.49,15.74 U4.1
  Bottom 0.406: v26.54,10.41 26.54,7.37 v25.65,6.48
VUSB  (via drill 0.41)
  Top 0.305: 39.9,21.34 U2.2 39.85,21.34
  Top 0.406: 39.9,21.34 C19.1 v46.57,21.34 | U2.7 37.88,25.31 37.21,24.64 37.21,22.1 37.97,21.34 39.85,21.34 | v39.97,14.1 v42.5,14.1 v42.51,14.1
  Bottom 0.406: 46.19,13.97 46.19,20.95 v46.57,21.34 | D1.+ 39.97,15.84 D6.A v39.97,14.1 | v42.51,14.1 46.06,14.1 46.19,13.97 | J5.1 45.75,12.89 46.19,13.34 46.19,13.97
XTAL3
  Top 0.305: U2.16 34.87,31.45 R5.2 35.54,32.12 Y2.1
XTAL4
  Top 0.305: U2.17 34.07,31.59 R5.1 33.54,32.12 Y2.3

### Text on the board
tPlace: v1.0 | www.elecrow.com | 32u4 with A9G GPRS/GSM/GPS
bPlace: A0 | IIC | + | - | D6 | D7